# EAGLE design register (EAGLE 9.5.1)

## Sheet 1 of 3
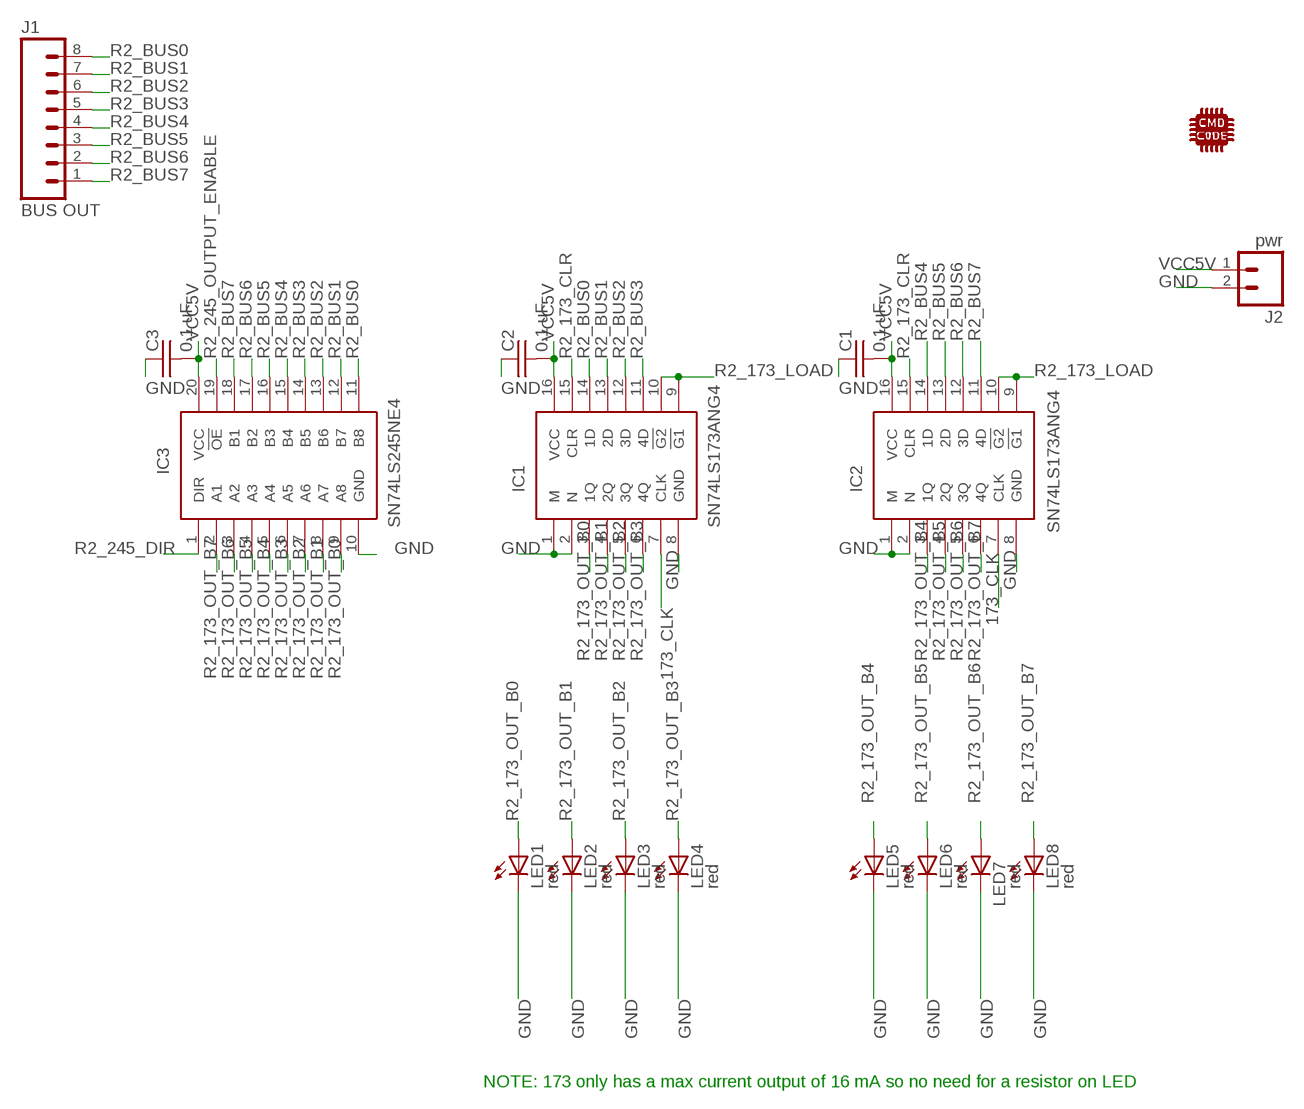
[diagram p0: schematic, sheet 1]

### Parts
C1  0.1 uF  C-US075-032X103  [C075-032X103]
C2  0.1 uF  C-US075-032X103  [C075-032X103]
C3  0.1 uF  C-US075-032X103  [C075-032X103]
IC1  SN74LS173ANG4  [DIP794W53P254L1930H508Q16N]
IC2  SN74LS173ANG4  [DIP794W53P254L1930H508Q16N]
IC3  SN74LS245NE4  [DIP794W53P254L2540H508Q20N]
J1  BUS OUT  M08  [1X08_ROUND]
J2  pwr  M02PTH  [1X02]
LED1  red  LED3MM  [LED3MM]
LED2  red  LED3MM  [LED3MM]
LED3  red  LED3MM  [LED3MM]
LED4  red  LED3MM  [LED3MM]
LED5  red  LED3MM  [LED3MM]
LED6  red  LED3MM  [LED3MM]
LED7  red  LED3MM  [LED3MM]
LED8  red  LED3MM  [LED3MM]
U$1  CMD_C0DE_LOGOCMD_CODE_LOGO_TOP_COPPER  [CMD_C0DE_LOGO_TOP_COPPER]

### Nets
173_CLK: IC1.7(CLK) IC2.7(CLK) ; also sheet 2,3
GND: C1.1 C2.1 C3.1 IC1.1(M) IC1.2(N) IC1.8(GND) IC2.1(M) IC2.2(N) IC2.8(GND) IC3.10(GND) J2.2 LED1.K(C) LED2.K(C) LED3.K(C) LED4.K(C) LED5.K(C) LED6.K(C) LED7.K(C) LED8.K(C) ; also sheet 2,3
R2_173_CLR: IC1.15(CLR) IC2.15(CLR) ; also sheet 3
R2_173_LOAD: IC1.9(!G1) IC1.10(!G2) IC2.9(!G1) IC2.10(!G2) ; also sheet 3
R2_173_OUT_B0: IC1.3(1Q) IC3.9(A8) LED1.A
R2_173_OUT_B1: IC1.4(2Q) IC3.8(A7) LED2.A
R2_173_OUT_B2: IC1.5(3Q) IC3.7(A6) LED3.A
R2_173_OUT_B3: IC1.6(4Q) IC3.6(A5) LED4.A
R2_173_OUT_B4: IC2.3(1Q) IC3.5(A4) LED5.A
R2_173_OUT_B5: IC2.4(2Q) IC3.4(A3) LED6.A
R2_173_OUT_B6: IC2.5(3Q) IC3.3(A2) LED7.A
R2_173_OUT_B7: IC2.6(4Q) IC3.2(A1) LED8.A
R2_245_DIR: IC3.1(DIR) ; also sheet 3
R2_245_OUTPUT_ENABLE: IC3.19(!OE) ; also sheet 3
R2_BUS0: IC1.14(1D) IC3.11(B8) J1.8
R2_BUS1: IC1.13(2D) IC3.12(B7) J1.7
R2_BUS2: IC1.12(3D) IC3.13(B6) J1.6
R2_BUS3: IC1.11(4D) IC3.14(B5) J1.5
R2_BUS4: IC2.14(1D) IC3.15(B4) J1.4
R2_BUS5: IC2.13(2D) IC3.16(B3) J1.3
R2_BUS6: IC2.12(3D) IC3.17(B2) J1.2
R2_BUS7: IC2.11(4D) IC3.18(B1) J1.1
VCC5V: C1.2 C2.2 C3.2 IC1.16(VCC) IC2.16(VCC) IC3.20(VCC) J2.1 ; also sheet 2,3

### Notes on the sheet
- NOTE: 173 only has a max current output of 16 mA so no need for a resistor on LED

## Sheet 2 of 3
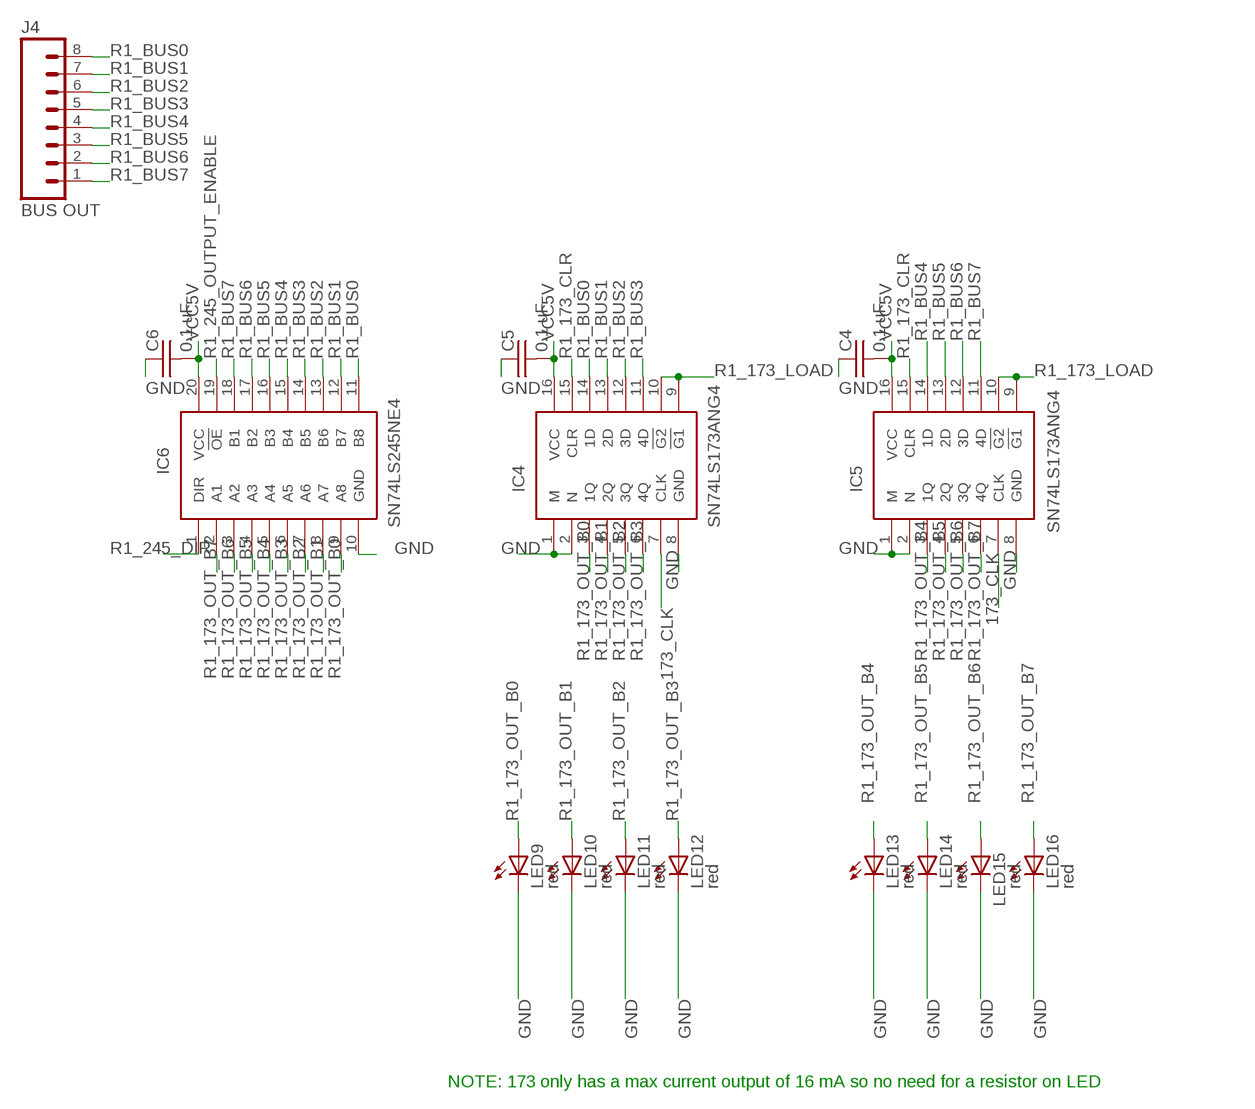
[diagram p1: schematic, sheet 2]

### Parts
C4  0.1 uF  C-US075-032X103  [C075-032X103]
C5  0.1 uF  C-US075-032X103  [C075-032X103]
C6  0.1 uF  C-US075-032X103  [C075-032X103]
IC4  SN74LS173ANG4  [DIP794W53P254L1930H508Q16N]
IC5  SN74LS173ANG4  [DIP794W53P254L1930H508Q16N]
IC6  SN74LS245NE4  [DIP794W53P254L2540H508Q20N]
J4  BUS OUT  M08  [1X08_ROUND]
LED9  red  LED3MM  [LED3MM]
LED10  red  LED3MM  [LED3MM]
LED11  red  LED3MM  [LED3MM]
LED12  red  LED3MM  [LED3MM]
LED13  red  LED3MM  [LED3MM]
LED14  red  LED3MM  [LED3MM]
LED15  red  LED3MM  [LED3MM]
LED16  red  LED3MM  [LED3MM]

### Nets
173_CLK: IC4.7(CLK) IC5.7(CLK) ; also sheet 1,3
GND: C4.1 C5.1 C6.1 IC4.1(M) IC4.2(N) IC4.8(GND) IC5.1(M) IC5.2(N) IC5.8(GND) IC6.10(GND) LED9.K(C) LED10.K(C) LED11.K(C) LED12.K(C) LED13.K(C) LED14.K(C) LED15.K(C) LED16.K(C) ; also sheet 1,3
R1_173_CLR: IC4.15(CLR) IC5.15(CLR) ; also sheet 3
R1_173_LOAD: IC4.9(!G1) IC4.10(!G2) IC5.9(!G1) IC5.10(!G2) ; also sheet 3
R1_173_OUT_B0: IC4.3(1Q) IC6.9(A8) LED9.A
R1_173_OUT_B1: IC4.4(2Q) IC6.8(A7) LED10.A
R1_173_OUT_B2: IC4.5(3Q) IC6.7(A6) LED11.A
R1_173_OUT_B3: IC4.6(4Q) IC6.6(A5) LED12.A
R1_173_OUT_B4: IC5.3(1Q) IC6.5(A4) LED13.A
R1_173_OUT_B5: IC5.4(2Q) IC6.4(A3) LED14.A
R1_173_OUT_B6: IC5.5(3Q) IC6.3(A2) LED15.A
R1_173_OUT_B7: IC5.6(4Q) IC6.2(A1) LED16.A
R1_245_DIR: IC6.1(DIR) ; also sheet 3
R1_245_OUTPUT_ENABLE: IC6.19(!OE) ; also sheet 3
R1_BUS0: IC4.14(1D) IC6.11(B8) J4.8
R1_BUS1: IC4.13(2D) IC6.12(B7) J4.7
R1_BUS2: IC4.12(3D) IC6.13(B6) J4.6
R1_BUS3: IC4.11(4D) IC6.14(B5) J4.5
R1_BUS4: IC5.14(1D) IC6.15(B4) J4.4
R1_BUS5: IC5.13(2D) IC6.16(B3) J4.3
R1_BUS6: IC5.12(3D) IC6.17(B2) J4.2
R1_BUS7: IC5.11(4D) IC6.18(B1) J4.1
VCC5V: C4.2 C5.2 C6.2 IC4.16(VCC) IC5.16(VCC) IC6.20(VCC) ; also sheet 1,3

### Notes on the sheet
- NOTE: 173 only has a max current output of 16 mA so no need for a resistor on LED

## Sheet 3 of 3
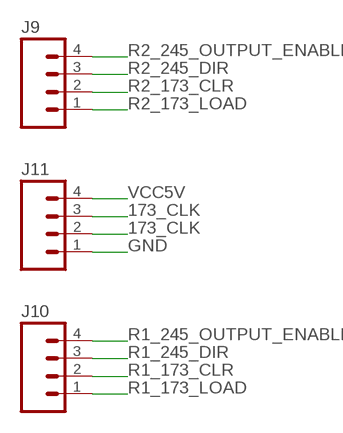
[diagram p2: schematic, sheet 3]

### Parts
J9  M04PTH  [1X04]
J10  M04PTH  [1X04]
J11  M04PTH  [1X04]

### Nets
173_CLK: J11.2 J11.3 ; also sheet 1,2
GND: J11.1 ; also sheet 1,2
R1_173_CLR: J10.2 ; also sheet 2
R1_173_LOAD: J10.1 ; also sheet 2
R1_245_DIR: J10.3 ; also sheet 2
R1_245_OUTPUT_ENABLE: J10.4 ; also sheet 2
R2_173_CLR: J9.2 ; also sheet 1
R2_173_LOAD: J9.1 ; also sheet 1
R2_245_DIR: J9.3 ; also sheet 1
R2_245_OUTPUT_ENABLE: J9.4 ; also sheet 1
VCC5V: J11.4 ; also sheet 1,2

## Library data of the parts
C1-C6 = passives:C-US: CAPACITOR, American symbol
IC1 IC2 IC4 IC5 = ICs:SN74LS173ANG4: IC D-TYPE POS TRG SNGL 16DIP Source: Datasheet <http://www.ti.com/lit/ds/symlink/sn74ls173a.pdf>; DESCRIPTION: IC D-TYPE POS TRG SNGL 16DIP; HEIGHT: 5.08mm; MANUFACTURER_NAME: Texas Instruments; MANUFACTURER_PART_NUMBER: SN74LS173ANG4
IC3 IC6 = ICs:SN74LS245NE4: Bus Transceivers Octal bus Transceiver Source: Datasheet <http://www.ti.com/lit/ds/symlink/sn74ls245.pdf>; DESCRIPTION: Bus Transceivers Octal bus Transceiver; HEIGHT: 5.08mm; MANUFACTURER_NAME: Texas Instruments; MANUFACTURER_PART_NUMBER: SN74LS245NE4; MOUSER_PART_NUMBER: 595-SN74LS245NE4; MOUSER_PRICE-STOCK: https://www.mouser.com/Search/Refine.aspx?Keyword=595-SN74LS245NE4
J1 J4 = connector:M08: Header 8 Standard 8-pin 0.1" header. Use with straight break away headers (SKU : PRT-00116), right angle break away headers (PRT-00553), swiss pins (PRT-00743), machine pins (PRT-00117), and female headers (PRT-00115).; PROD_ID: CONN-08437
J2 = connector:M02: Standard 2-pin 0.1" header. Use with - straight break away headers ( PRT-00116) - right angle break away headers (PRT-00553) - swiss pins (PRT-00743) - machine pins (PRT-00117) - female headers (PRT-00115) Molex polarized connector foot print use with: PRT-08233 with associated crimp pins and housings. 2.54_SCREWTERM for use with PRT-10571. 3.5mm Screw Terminal footprints for PRT-08084 5mm Screw Terminal footprints for use with PRT-08432
J9-J11 = connector:M04: Header 4 Standard 4-pin 0.1" header. Use with straight break away headers (SKU : PRT-00116), right angle break away headers (PRT-00553), swiss pins (PRT-00743), machine pins (PRT-00117), and female headers (PRT-00115). Molex polarized connector foot print use with SKU : PRT-08231 with associated crimp pins and housings. 1MM SMD Version SKU: PRT-10208; PROD_ID: CONN-09696
LED1-LED16 = leds:LED: LEDs Standard schematic elements and footprints for 5mm, 3mm, 1206, and 0603 sized LEDs. 5mm - Spark Fun Electronics SKU : COM-00529 (and others)
U$1 = logos:CMD_C0DE_LOGO

## Board
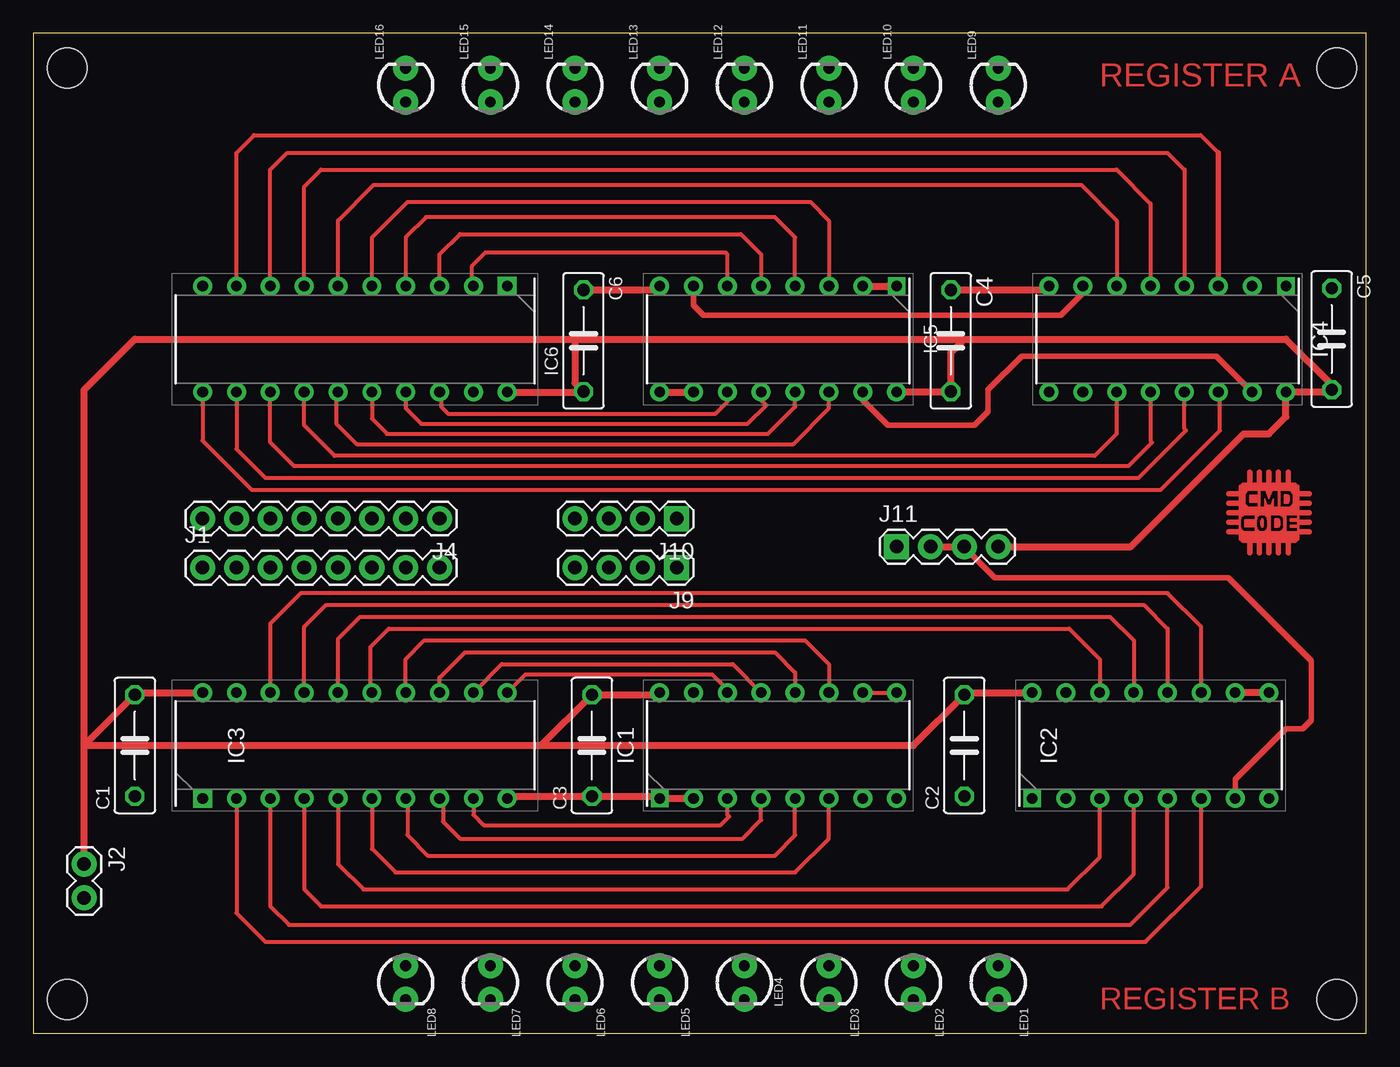
[diagram p3: board, top side]
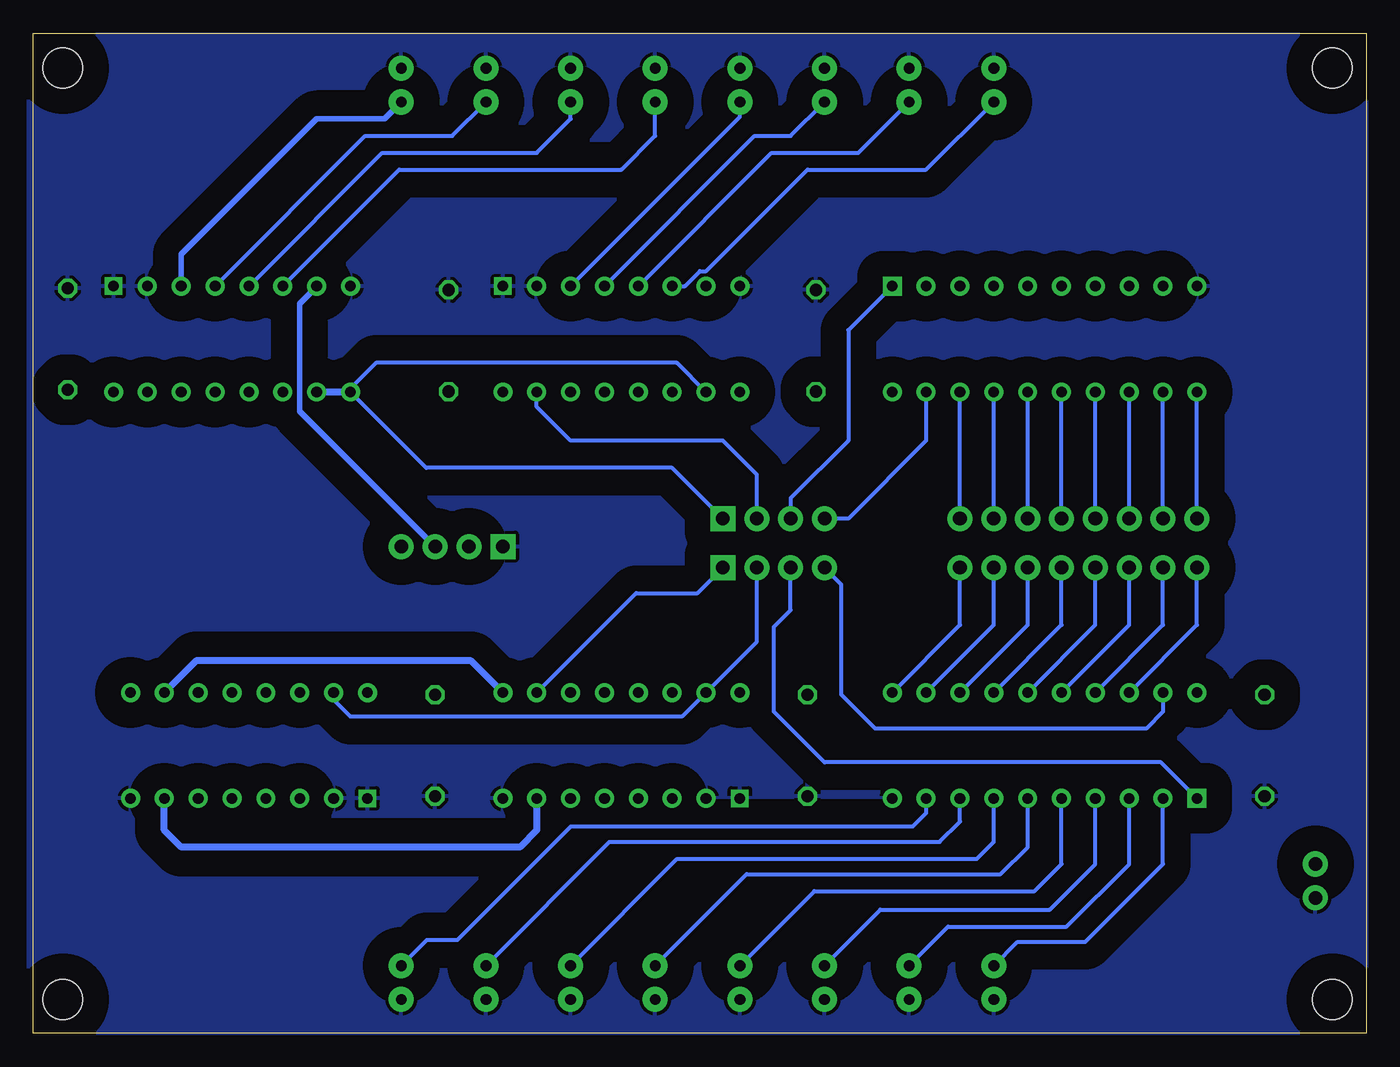
[diagram p4: board, bottom side, seen from below]

Size 100 x 75 mm. Coordinates in mm from the lower left corner, seen from the top.
Outline: 0,0 100,0 100,75 0,75 0,0
Copper layers (1*16): Top 0.035mm / dielectric 1.5mm / Bottom 0.035mm
Design rules "OthermillDRC_1_100_v2": minimum track width 8mil, minimum drill 0.8mm, track to track 0.256540625mm, track to pad 0.256540625mm, pad to pad 0.256540625mm, via to via 0.256540625mm, smd to smd 0mil, copper to edge 0mil, drill to drill 1mil, minimum pad ring 10mil, minimum via ring 10mil, stop-mask expansion 1mil, vias tented up to drill 30mil, thermal gap 10mil
Holes 3 mm at 2.54,72.39 97.79,72.39 97.79,2.54 2.54,2.54

### Footprints (pad centres in the part's own frame; a part is rotated, then mirrored left to right if it is on the bottom)
C075-032X103 = drill 0.914 octagon: 1 -3.81,0; 2 3.81,0
DIP794W53P254L1930H508Q16N = drill 0.8 pad 1.27 square: 1 -3.97,8.89 | drill 0.8 pad 1.422: 2 -3.97,6.35; 3 -3.97,3.81; 4 -3.97,1.27; 5 -3.97,-1.27; 6 -3.97,-3.81; 7 -3.97,-6.35; 8 -3.97,-8.89; 9 3.97,-8.89; 10 3.97,-6.35; 11 3.97,-3.81; 12 3.97,-1.27; 13 3.97,1.27; 14 3.97,3.81; 15 3.97,6.35; 16 3.97,8.89
DIP794W53P254L2540H508Q20N = drill 0.8 pad 1.422 square: 1 -3.97,11.43 | drill 0.8 pad 1.422: 2 -3.97,8.89; 3 -3.97,6.35; 4 -3.97,3.81; 5 -3.97,1.27; 6 -3.97,-1.27; 7 -3.97,-3.81; 8 -3.97,-6.35; 9 -3.97,-8.89; 10 -3.97,-11.43; 11 3.97,-11.43; 12 3.97,-8.89; 13 3.97,-6.35; 14 3.97,-3.81; 15 3.97,-1.27; 16 3.97,1.27; 17 3.97,3.81; 18 3.97,6.35; 19 3.97,8.89; 20 3.97,11.43
1X08_ROUND = drill 1.016 pad 1.88: 1 0,0; 2 2.54,0; 3 5.08,0; 4 7.62,0; 5 10.16,0; 6 12.7,0; 7 15.24,0; 8 17.78,0
1X02 = drill 1.016 pad 1.88: 1 0,0; 2 2.54,0
1X04 = drill 1.016 pad 1.88 square: 1 0,0 | drill 1.016 pad 1.88: 2 2.54,0; 3 5.08,0; 4 7.62,0
LED3MM = drill 0.813 pad 1.88: A -1.27,0; K 1.27,0

### Placement (x,y rotation side)
C1  7.62,21.59 90 top
C2  69.85,21.59 90 top
C3  41.91,21.59 90 top
C4  68.83,51.94 270 top
C5  97.41,52.07 270 top
C6  41.27,51.94 270 top
IC1  55.88,21.59 90 top
IC2  83.82,21.59 90 top
IC3  24.13,21.59 90 top
IC4  85.09,52.07 270 top
IC5  55.88,52.07 270 top
IC6  24.13,52.07 270 top
J1  12.7,34.92 0 top
J2  3.81,12.7 270 top
J4  30.48,38.61 180 top
J9  48.26,34.92 180 top
J10  48.26,38.61 180 top
J11  64.77,36.5 0 top
LED1  72.39,3.81 270 top
LED2  66.04,3.81 270 top
LED3  59.69,3.81 270 top
LED4  53.34,3.81 270 top
LED5  46.99,3.81 270 top
LED6  40.64,3.81 270 top
LED7  34.29,3.81 270 top
LED8  27.94,3.81 270 top
LED9  72.39,71.12 90 top
LED10  66.04,71.12 90 top
LED11  59.69,71.12 90 top
LED12  53.34,71.12 90 top
LED13  46.99,71.12 90 top
LED14  40.64,71.12 90 top
LED15  34.29,71.12 90 top
LED16  27.94,71.12 90 top
U$1  92.71,39.37 0 top

### Tracks (layer width: path | path; a pad name or v marks a point on that pad's centre or on a via)
173_CLK
  Top 0.406: IC5.7 49.53,54.61 50.29,53.85 77.09,53.85 78.74,55.5 IC4.7 | IC2.7 90.17,19.05 93.98,22.86 95.25,22.86 95.89,23.5 95.89,27.94 89.66,34.16 72.14,34.16 69.85,36.45 J11.3
  Top 0.508: J11.2 J11.3
  Bottom 0.406: IC4.7 78.74,56.01 80.01,54.74 80.01,46.66 J11.3
  Bottom 0.508: IC1.7 62.23,15.24 63.5,13.97 88.9,13.97 90.17,15.24 IC2.7
GND
  Top 0.508: IC3.10 35.72,17.78 C3.1 46.83,17.78 IC1.1 IC1.2 | IC5.2 IC5.1 | C6.1 46.7,55.75 IC5.8 | C4.1 75.91,55.75 IC4.8
  pour Bottom (isolate 1.93): 0,74.93 0,0 100.33,0 100.33,74.93
R1_173_CLR
  Top 0.406: IC4.15 88.74,50.8 74.17,50.8 71.63,48.26 71.63,46.61 70.61,45.59 64.14,45.59 62.23,47.5 IC5.15
  Bottom 0.305: J10.2 45.72,41.91 48.26,44.45 59.69,44.45 62.23,46.99 IC5.15
R1_173_LOAD
  Top 0.508: IC5.9 IC5.10
  Bottom 0.305: IC5.10 51.72,50.29 74.3,50.29 76.2,48.39 IC4.9 70.52,42.42 52.07,42.42 J10.1
  Bottom 0.508: IC4.9 IC4.10
R1_173_OUT_B0
  Top 0.305: IC6.9 15.24,66.04 16.56,67.36 87.58,67.36 88.9,66.04
  Top 0.406: IC4.3 88.9,66.04
  Bottom 0.406: LED9.A 73.66,68.58 78.74,68.58 88.9,58.42 IC4.3
R1_173_OUT_B1
  Top 0.305: IC6.8 17.78,64.77 19.05,66.04 85.09,66.04 86.36,64.77 IC4.4
  Bottom 0.305: IC4.4 75.09,67.31 68.58,67.31 LED10.A
R1_173_OUT_B2
  Top 0.305: IC6.7 20.32,63.5 21.59,64.77 81.28,64.77 83.82,62.23 IC4.5
  Bottom 0.305: IC4.5 73.82,66.04 62.23,66.04 59.69,68.58 LED11.A
R1_173_OUT_B3
  Top 0.305: IC6.6 22.86,60.96 25.53,63.63 78.61,63.63 81.28,60.96 IC4.6
  Bottom 0.305: IC4.6 72.55,64.77 55.88,64.77 53.34,67.31 LED12.A
R1_173_OUT_B4
  Top 0.305: IC6.5 25.4,59.69 28.07,62.36 58.29,62.36 59.69,60.96 IC5.3
  Bottom 0.305: IC5.3 46.99,68.74 LED13.A
R1_173_OUT_B5
  Top 0.305: IC5.4 57.15,59.69 55.63,61.21 29.46,61.21 27.94,59.69 IC6.4
  Bottom 0.305: IC5.4 45.88,67.31 43.18,67.31 LED14.A
R1_173_OUT_B6
  Top 0.305: IC6.3 30.48,58.42 32,59.94 53.09,59.94 54.61,58.42 IC5.5
  Bottom 0.305: IC5.5 44.61,66.04 38.1,66.04 LED15.A
R1_173_OUT_B7
  Top 0.305: IC5.6 52.07,58.42 51.94,58.55 33.91,58.55 32.89,57.53 32.89,56.17 IC6.2
  Bottom 0.305: IC5.6 51.11,56.04 49.99,57.16 49.52,57.16 41.91,64.77 33.02,64.77 LED16.A
R1_245_DIR
  Bottom 0.305: IC6.1 38.86,52.74 38.86,44.45 43.18,40.13 J10.3
R1_245_OUTPUT_ENABLE
  Bottom 0.305: IC6.19 33.02,44.45 38.86,38.61 J10.4
R1_BUS0
  Top 0.305: IC6.11 12.7,44.45 16.38,40.77 84.58,40.77 89.03,45.21 89.03,47.97 IC4.14
  Bottom 0.305: J4.8 IC6.11
R1_BUS1
  Top 0.305: IC6.12 15.24,43.81 17.4,41.66 82.93,41.66 86.49,45.21 86.36,45.34 IC4.13
  Bottom 0.305: J4.7 IC6.12
R1_BUS2
  Top 0.305: IC4.12 83.82,44.45 83.95,44.32 82.17,42.55 19.56,42.55 17.78,44.32 IC6.13
  Bottom 0.305: J4.6 IC6.13
R1_BUS3
  Top 0.305: IC4.11 81.28,44.96 79.63,43.31 22.61,43.31 20.32,45.59 IC6.14
  Bottom 0.305: J4.5 IC6.14
R1_BUS4
  Top 0.305: IC6.15 22.73,47.97 22.73,45.72 24.26,44.2 57.02,44.2 59.69,46.86 IC5.14
  Bottom 0.305: J4.4 IC6.15
R1_BUS5
  Top 0.305: IC6.16 25.4,46.1 26.54,44.96 55.12,44.96 57.15,46.99 IC5.13
  Bottom 0.305: J4.3 IC6.16
R1_BUS6
  Top 0.305: IC6.17 27.94,46.86 29.08,45.72 53.59,45.72 54.99,47.12 54.61,47.5 IC5.12
  Bottom 0.305: J4.2 IC6.17
R1_BUS7
  Top 0.305: IC6.18 30.61,47.97 30.61,46.99 31.11,46.48 51.18,46.48 52.07,47.37 IC5.11
  Bottom 0.305: J4.1 IC6.18
R2_173_CLR
  Bottom 0.305: IC2.15 77.47,25.02 76.2,23.75 51.34,23.75 IC1.15 45.72,29.37 J9.2
R2_173_LOAD
  Top 0.305: IC1.10 IC1.9
  Top 0.508: IC2.9 IC2.10
  Bottom 0.305: IC1.10 54.77,33.02 50.16,33.02 J9.1
  Bottom 0.508: IC1.9 67.15,27.94 87.79,27.94 IC2.10
R2_173_OUT_B0
  Top 0.305: IC3.9 33.02,16.38 33.78,15.62 51.56,15.62 52.2,16.26 52.07,16.38 IC1.3
  Bottom 0.305: IC3.9 33.02,16.51 34.04,15.49 59.69,15.49 68.2,6.99 70.48,6.99 LED1.A
R2_173_OUT_B1
  Top 0.305: IC3.8 30.73,17.37 30.73,15.88 32,14.61 53.21,14.61 54.61,16 IC1.4
  Bottom 0.305: LED2.A 56.77,14.35 32,14.35 30.48,15.88 IC3.8
R2_173_OUT_B2
  Top 0.305: IC3.7 28.07,17.49 28.07,14.86 29.59,13.34 55.63,13.34 57.15,14.86 IC1.5
  Bottom 0.305: LED3.A 51.69,13.08 29.21,13.08 27.94,14.35 IC3.7
R2_173_OUT_B3
  Top 0.305: IC3.6 25.4,13.84 27.18,12.06 57.15,12.06 59.69,14.61 IC1.6
  Bottom 0.305: LED4.A 46.48,11.94 27.43,11.94 25.4,13.97 IC3.6
R2_173_OUT_B4
  Top 0.305: IC3.5 22.86,12.7 24.77,10.79 77.6,10.79 80.01,13.21 IC2.3
  Bottom 0.305: LED5.A 41.4,10.67 24.89,10.67 22.86,12.7 IC3.5
R2_173_OUT_B5
  Top 0.305: IC3.4 20.32,10.79 21.59,9.53 80.14,9.53 82.55,11.94 IC2.4
  Bottom 0.305: LED6.A 36.45,9.27 23.75,9.27 20.32,12.7 IC3.4
R2_173_OUT_B6
  Top 0.305: IC3.3 17.78,9.53 19.18,8.13 82.3,8.13 85.09,10.92 IC2.5
  Bottom 0.305: LED7.A 31.37,8 22.48,8 17.78,12.7 IC3.3
R2_173_OUT_B7
  Top 0.305: IC3.2 15.24,9.02 17.4,6.86 83.44,6.86 87.63,11.05 IC2.6
  Bottom 0.305: LED8.A 26.16,6.86 21.08,6.86 15.24,12.7 IC3.2
R2_245_DIR
  Bottom 0.305: IC3.1 15.4,20.32 40.64,20.32 44.45,24.13 44.45,30.48 43.18,31.75 J9.3
R2_245_OUTPUT_ENABLE
  Bottom 0.305: IC3.19 15.24,24.13 16.51,22.86 36.83,22.86 39.37,25.4 39.37,33.66 J9.4
R2_BUS0
  Top 0.305: IC3.11 36.92,26.92 50.93,26.92 52.07,25.78 IC1.14
  Bottom 0.305: IC3.11 30.48,30.64 J1.8
R2_BUS1
  Top 0.305: IC3.12 35.15,27.69 52.48,27.69 IC1.13
  Bottom 0.305: IC3.12 27.94,30.64 J1.7
R2_BUS2
  Top 0.305: IC1.12 57.15,27.05 55.63,28.57 32.38,28.57 30.48,26.67 IC3.13
  Bottom 0.305: IC3.13 25.4,30.64 J1.6
R2_BUS3
  Top 0.305: IC3.14 27.94,28.07 29.34,29.46 57.91,29.46 59.69,27.69 IC1.11
  Bottom 0.305: IC3.14 22.86,30.64 J1.5
R2_BUS4
  Top 0.305: IC3.15 25.27,25.69 25.27,28.96 26.67,30.35 77.72,30.35 80.01,28.07 IC2.14
  Bottom 0.305: IC3.15 20.32,30.64 J1.4
R2_BUS5
  Top 0.305: IC3.16 22.86,29.59 24.51,31.24 80.77,31.24 82.55,29.46 IC2.13
  Bottom 0.305: IC3.16 17.78,30.64 J1.3
R2_BUS6
  Top 0.305: IC3.17 20.32,30.48 21.97,32.13 83.31,32.13 85.09,30.35 IC2.12
  Bottom 0.305: IC3.17 15.24,30.64 J1.2
R2_BUS7
  Top 0.305: IC2.11 87.63,30.48 85.09,33.02 20.07,33.02 17.78,30.73 IC3.18
  Bottom 0.305: IC3.18 12.7,30.64 J1.1
VCC5V
  Top 0.508: 3.81,21.59 C1.2 7.78,25.56 IC3.20 | 3.81,21.59 38.1,21.59 | 38.1,21.59 C3.2 46.83,25.4 IC1.16 | 38.1,21.59 66.04,21.59 C2.2 70.01,25.56 IC2.16 | 3.81,21.59 3.81,48.26 7.62,52.07 40.64,52.07 | 40.64,52.07 40.64,48.77 C6.2 41.24,48.1 IC6.20 | 40.64,52.07 69.85,52.07 | 69.85,52.07 68.83,51.05 C4.2 64.8,48.13 IC5.16 | 69.85,52.07 93.98,52.07 97.41,48.64 C5.2 97.25,48.1 IC4.16 93.98,46.23 92.71,44.96 90.81,44.96 82.35,36.5 J11.4 | J2.1 3.81,21.59

### Text on the board
Top: REGISTER A | REGISTER B